# Altium schematic sheet 全场定位RM_v1.2.SchDoc
size A3; SheetNumber: 1; SheetTotal: 1
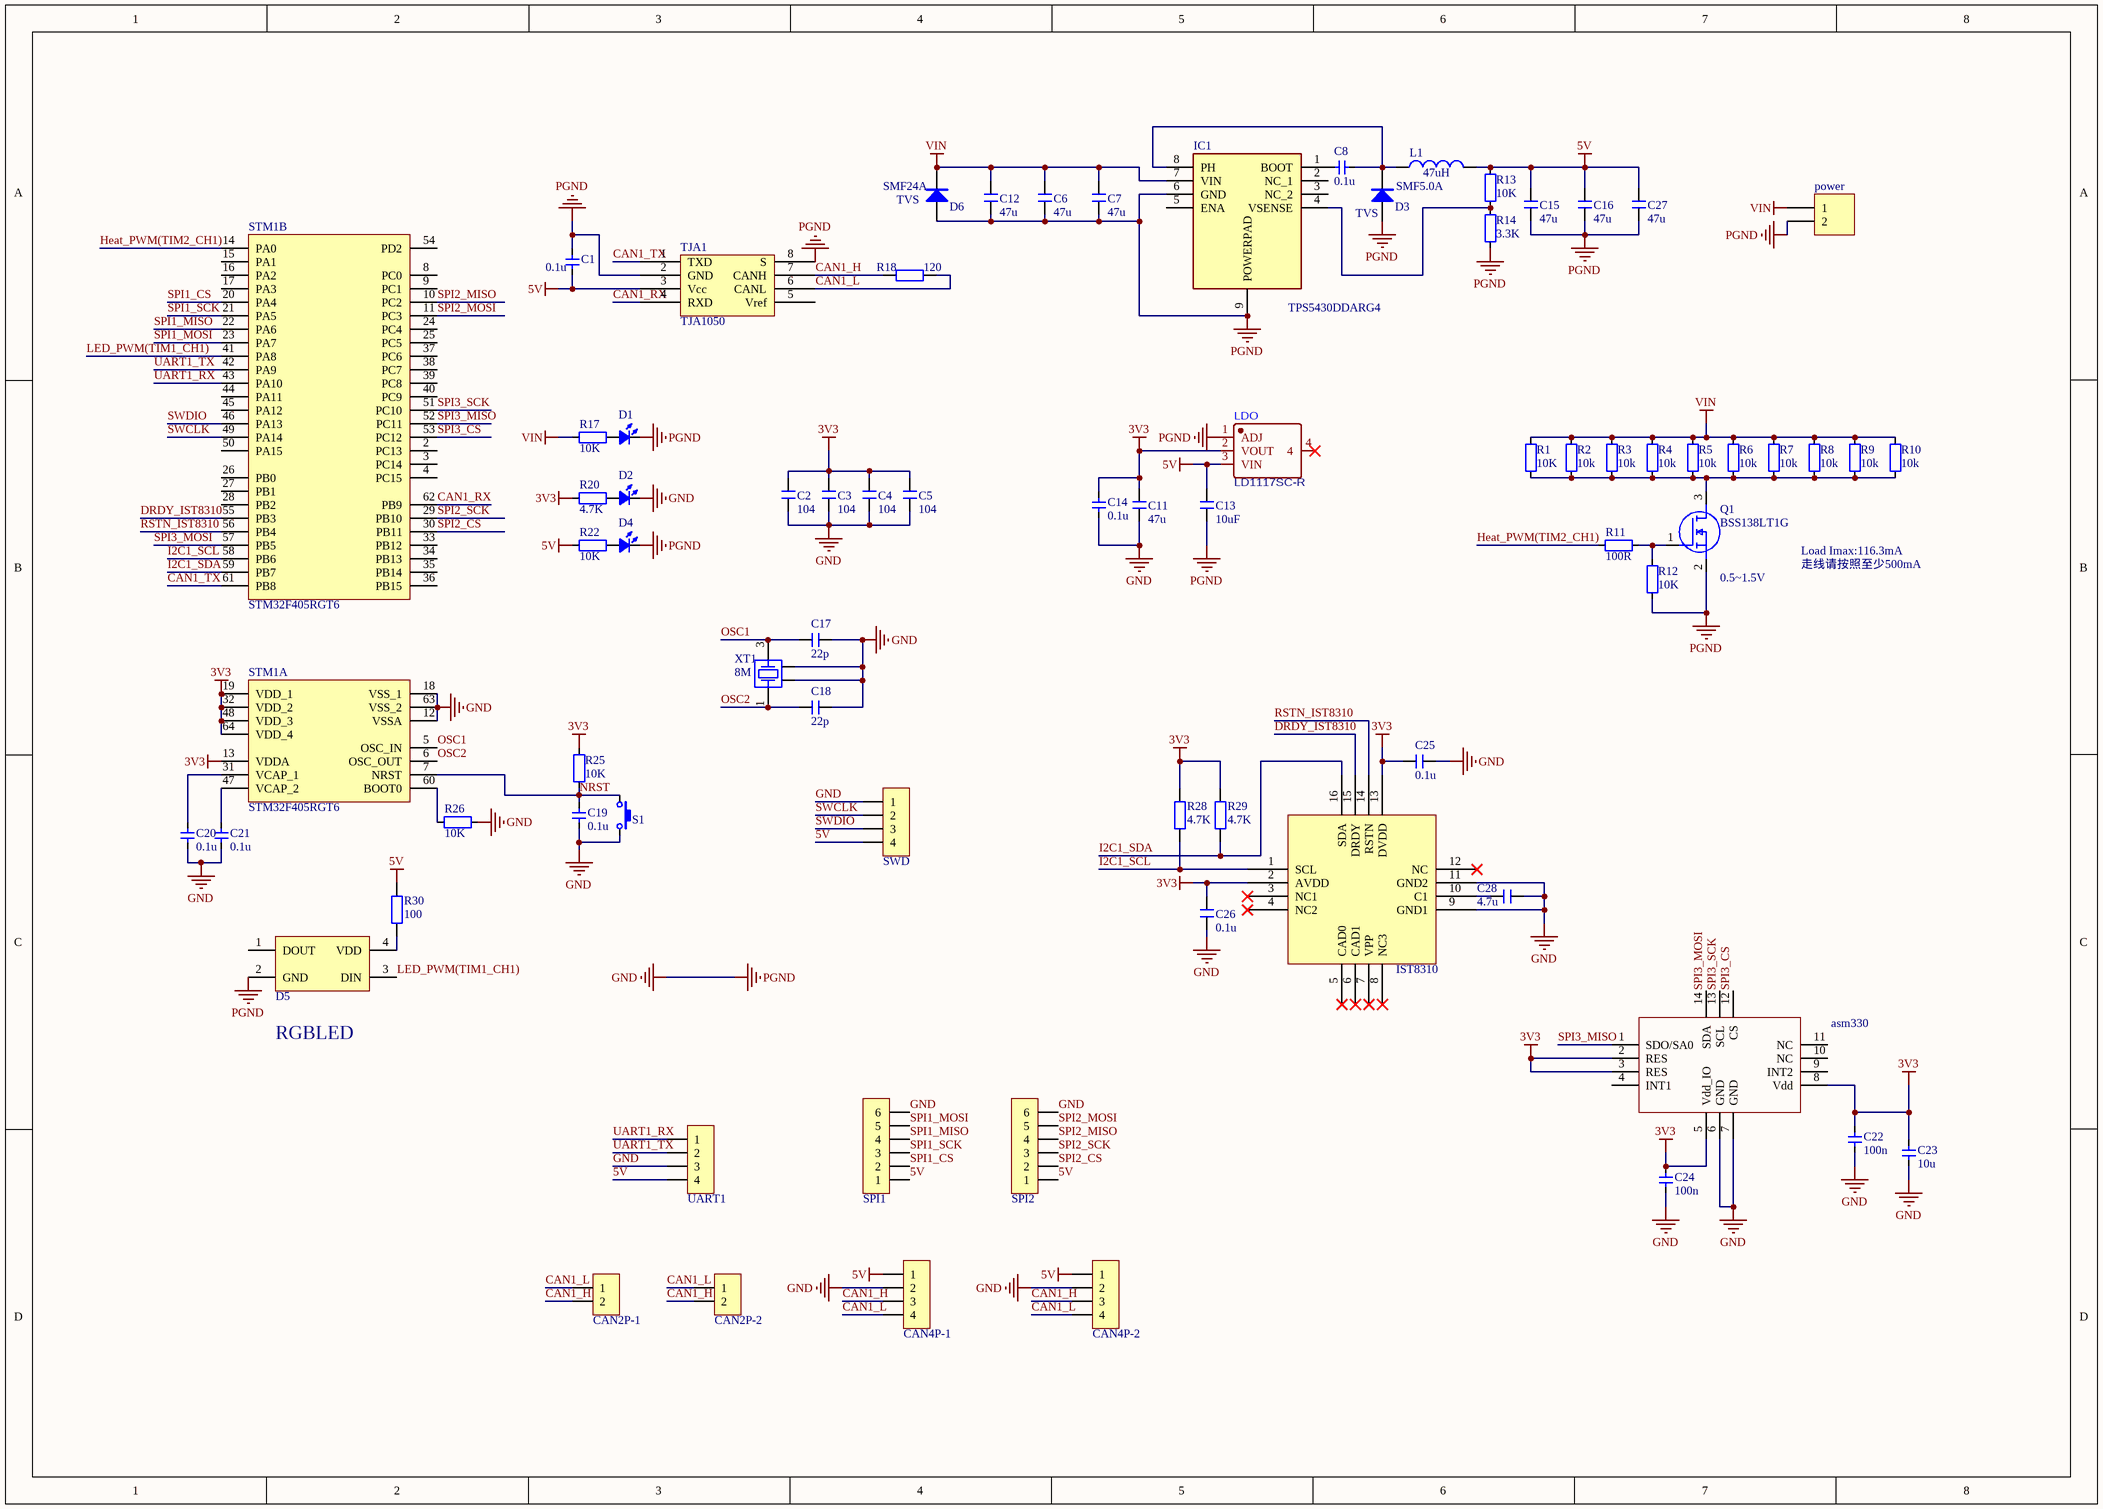
[diagram p0: 全场定位RM_v1.2.SchDoc]

## Parts
?  IST8310  [LGA-16(3mm*3mm)]
asm330  ASM330LHH  [LGA-14(2.5X3X0.86)]  (value not drawn)
C1  value 0.1u  [C 0603_L]  (hidden comment: Cap_0603)
C2  104  [C 0603_L]
C3  104  [C 0603_L]
C4  104  [C 0603_L]
C5  104  [C 0603_L]
C6  47u  [C 1206_L]
C7  47u  [C 1206_L]
C8  value 0.1u  [C 0603_L]  (hidden comment: Cap_0603)
C11  47u  [C 1206_L]
C12  47u  [C 1206_L]
C13  10uF  [C 0603_L]
C14  value 0.1u  [C 0603_L]  (hidden comment: Cap_0603)
C15  47u  [C 1206_L]
C16  47u  [C 1206_L]
C17  22p  [C 0603_L]
C18  22p  [C 0603_L]
C19  value 0.1u  [C 0603_L]  (hidden comment: Cap_0603)
C20  value 0.1u  [C 0603_L]  (hidden comment: Cap_0603)
C21  value 0.1u  [C 0603_L]  (hidden comment: Cap_0603)
C22  value 100n  [C 0603_L]  (hidden comment: Cap_0603)
C23  value 10u  [C 0603_L]  (hidden comment: Cap_0603)
C24  value 100n  [C 0603_L]  (hidden comment: Cap_0603)
C25  0.1u  [C 0603_L]
C26  0.1u  [C 0603_L]
C27  47u  [C 1206_L]
C28  4.7u  [C 0603_L]
CAN2P-1  HDR-1X2  [GH1.25-LT-2P]  (value not drawn)
CAN2P-2  HDR-1X2  [GH1.25-LT-2P]  (value not drawn)
CAN4P-1  HDR-1X4  [GH1.25-LS-4P]  (value not drawn)
CAN4P-2  HDR-1X4  [GH1.25-LS-4P]  (value not drawn)
D1  LED_0805  [LED_0805_YELLOW]  (value not drawn)
D2  LED_0805  [LED_0805_YELLOW]  (value not drawn)
D3  TVS  [SOD-123F]  (value not drawn)
D4  LED_0805  [LED_0805_YELLOW]  (value not drawn)
D5  LED_3535_SK6812  [LED_3535_4P]  (value not drawn)
D6  TVS  [SOD-123F]  (value not drawn)
IC1  TPS5430DDARG4  [SOIC127P600X170-9N]
L1  value 47uH  [CD73]  (hidden comment: Inductor)
LDO  LD1117SC-R  [SOT-223]
power  Header 2  [XT30-M]  (value not drawn)
Q1  BSS138LT1G  [SOT96P237X111-3N]
R1  value 10K  [R 0402_L]  (hidden comment: Res_0603)
R2  value 10k  [R 0402_L]  (hidden comment: Res_0603)
R3  value 10k  [R 0402_L]  (hidden comment: Res_0603)
R4  value 10k  [R 0402_L]  (hidden comment: Res_0603)
R5  value 10k  [R 0402_L]  (hidden comment: Res_0603)
R6  value 10k  [R 0402_L]  (hidden comment: Res_0603)
R7  value 10k  [R 0402_L]  (hidden comment: Res_0603)
R8  value 10k  [R 0402_L]  (hidden comment: Res_0603)
R9  value 10k  [R 0402_L]  (hidden comment: Res_0603)
R10  value 10k  [R 0402_L]  (hidden comment: Res_0603)
R11  value 100R  [R 0603_L]  (hidden comment: Res_0603)
R12  value 10K  [R 0603_L]  (hidden comment: Res_0603)
R13  value 10K  [R 0603_L]  (hidden comment: Res_0603)
R14  value 3.3K  [R 0603_L]  (hidden comment: Res_0603)
R17  value 10K  [R 0603_L]  (hidden comment: Res_0603)
R18  120  [R 0603_L]
R20  value 4.7K  [R 0603_L]  (hidden comment: Res_0603)
R22  value 10K  [R 0603_L]  (hidden comment: Res_0603)
R25  value 10K  [R 0603_L]  (hidden comment: Res_0603)
R26  value 10K  [R 0603_L]  (hidden comment: Res_0603)
R28  4.7K  [R 0603_L]
R29  4.7K  [R 0603_L]
R30  100  [R 0603_L]
S1  ButtonTACT_3x4x2_180  [ButtonTACT_3x4x2_180H]  (value not drawn)
SPI1  HDR-1X6  [GH1.25-LS-6P]  (value not drawn)
SPI2  HDR-1X6  [GH1.25-LS-6P]  (value not drawn)
STM1  STM32F405RGT6  [LQFP64 10x10_M]  (parts A,B of 2)
SWD  HDR-1X4  [MX 1.25-WS-4P]  (value not drawn)
TJA1  TJA1050  [SOP_E150_8]
UART1  HDR-1X4  [GH1.25-LS-4P]  (value not drawn)
XT1  8M  [OSC 3225-4P]

## Nets
3V3: ?.2(AVDD) ?.13(DVDD) asm330.2(RES) asm330.3(RES) asm330.5(Vdd_IO) asm330.8(Vdd) C2.2 C3.2 C4.2 C5.2 C11.2 C14.1 C22.1 C23.1 C24.1 C25.1 C26.2 LDO.2(VOUT) R20.1 R25.1 R28.2 R29.2 STM1.13(VDDA) STM1.19(VDD_1) STM1.32(VDD_2) STM1.48(VDD_3) STM1.64(VDD_4)
5V: C1.1 C13.2 C15.2 C16.2 C27.2 CAN4P-1.1 CAN4P-2.1 L1.2 LDO.3(VIN) R13.1 R22.1 R30.2 SPI1.1 SPI2.1 SWD.4 TJA1.3(Vcc) UART1.4
GND: ?.9(GND1) ?.11(GND2) asm330.6(GND) asm330.7(GND) C1.2 C2.1 C3.1 C4.1 C5.1 C6.1 C7.1 C11.1 C12.1 C13.1 C14.2 C15.1 C16.1 C17.2 C18.2 C19.1 C20.2 C21.2 C22.2 C23.2 C24.2 C25.2 C26.1 C27.1 C28.1 CAN4P-1.2 CAN4P-2.2 D1.2(K) D2.2(K) D3.1(A) D4.2(K) D5.2(GND) D6.1(A) IC1.6(GND) IC1.9(POWERPAD) LDO.1(ADJ) power.2 Q1.2(S) R12.2 R14.2 R26.2 S1.2 SPI1.6 SPI2.6 STM1.12(VSSA) STM1.18(VSS_1) STM1.63(VSS_2) SWD.1 TJA1.2(GND) TJA1.8(S) UART1.3 XT1.2 XT1.4  [also labelled PGND]
VIN: C6.2 C7.2 C12.2 D6.2(K) IC1.7(VIN) power.1 R1.1 R2.1 R3.1 R4.1 R5.1 R6.1 R7.1 R8.1 R9.1 R10.1 R17.1
CAN1_H: CAN2P-1.2 CAN2P-2.2 CAN4P-1.3 CAN4P-2.3 R18.1 TJA1.7(CANH)
CAN1_L: CAN2P-1.1 CAN2P-2.1 CAN4P-1.4 CAN4P-2.4 R18.2 TJA1.6(CANL)
CAN1_RX: STM1.62(PB9) TJA1.4(RXD)
CAN1_TX: STM1.61(PB8) TJA1.1(TXD)
DRDY_IST8310: ?.15(DRDY) STM1.55(PB3)
Heat_PWM(TIM2_CH1): R11.1 STM1.14(PA0)
I2C1_SCL: ?.1(SCL) R28.1 STM1.58(PB6)
I2C1_SDA: ?.16(SDA) R29.1 STM1.59(PB7)
LED_PWM(TIM1_CH1): D5.3(DIN) STM1.41(PA8)
NRST: C19.2 R25.2 S1.1 STM1.7(NRST)
OSC1: C17.1 STM1.5(OSC_IN) XT1.3
OSC2: C18.1 STM1.6(OSC_OUT) XT1.1
RSTN_IST8310: ?.14(RSTN) STM1.56(PB4)
SPI1_CS: SPI1.2 STM1.20(PA4)
SPI1_MISO: SPI1.4 STM1.22(PA6)
SPI1_MOSI: SPI1.5 STM1.23(PA7)
SPI1_SCK: SPI1.3 STM1.21(PA5)
SPI2_CS: SPI2.2 STM1.30(PB11)
SPI2_MISO: SPI2.4 STM1.10(PC2)
SPI2_MOSI: SPI2.5 STM1.11(PC3)
SPI2_SCK: SPI2.3 STM1.29(PB10)
SPI3_CS: asm330.12(CS) STM1.53(PC12)
SPI3_MISO: asm330.1(SDO/SA0) STM1.52(PC11)
SPI3_MOSI: asm330.14(SDA) STM1.57(PB5)
SPI3_SCK: asm330.13(SCL) STM1.51(PC10)
SWCLK: STM1.49(PA14) SWD.2
SWDIO: STM1.46(PA13) SWD.3
UART1_RX: STM1.43(PA10) UART1.1
UART1_TX: STM1.42(PA9) UART1.2
Net?_10: ?.10(C1) C28.2
NetC8_1: C8.1 D3.2(K) IC1.8(PH) L1.1
NetC8_2: C8.2 IC1.1(BOOT)
NetC20_1: C20.1 STM1.31(VCAP_1)
NetC21_1: C21.1 STM1.47(VCAP_2)
NetD1_1: D1.1(A) R17.2
NetD2_1: D2.1(A) R20.2
NetD4_1: D4.1(A) R22.2
NetD5_4: D5.4(VDD) R30.1
NetIC1_4: IC1.4(VSENSE) R13.2 R14.1
NetQ1_1: Q1.1(G) R11.2 R12.1
NetQ1_3: Q1.3(D) R1.2 R2.2 R3.2 R4.2 R5.2 R6.2 R7.2 R8.2 R9.2 R10.2
NetR26_1: R26.1 STM1.60(BOOT0)

Not connected (* = marked no-connect by the designer): ? 3(NC1)* 4(NC2)* 5(CAD0)* 6(CAD1)* 7(VPP)* 8(NC3)* 12(NC)*; asm330 4(INT1) 9(INT2) 10(NC) 11(NC); D5 1(DOUT); IC1 2(NC_1) 3(NC_2) 5(ENA); LDO 4*; STM1 2(PC13) 3(PC14) 4(PC15) 8(PC0) 9(PC1) 15(PA1) 16(PA2) 17(PA3) 24(PC4) 25(PC5) 26(PB0) 27(PB1) 28(PB2) 33(PB12) 34(PB13) 35(PB14) 36(PB15) 37(PC6) 38(PC7) 39(PC8) 40(PC9) 44(PA11) 45(PA12) 50(PA15) 54(PD2); TJA1 5(Vref)

## Notes on the sheet
- (near D6) SMF24A
- (near D6) TVS
- (near D3) TVS
- SMF5.0A
- (near Q1) 0.5~1.5V
- Load Imax:116.3mA
- 走线请按照至少500mA
- (near D5) RGBLED

## Library data of the parts
C1 C8 C14 C19-C24 = Cap_0603: Capacitor
C2-C7 C11-C13 C15-C18 C25-C28 = C: 贴片电容; 淘宝ID: 小糖豆的小窝窝; BOM名称: 贴片电容; 下单链接: https://item.taobao.com/item.htm?ft=t&id=613637044352
CAN2P-1 CAN2P-2 = Header 2: 2P接插件; 淘宝ID: 小糖豆的小窝窝; BOM名称: 2P接插件; 下单链接: https://item.taobao.com/item.htm?ft=t&id=613637044352
CAN4P-1 CAN4P-2 SWD UART1 = Header 4: 4P接插件; 淘宝ID: 小糖豆的小窝窝; BOM名称: 4P接插件; 下单链接: https://item.taobao.com/item.htm?ft=t&id=613637044352
D1 D2 D4 = LED_0805: LED
D3 D6 = TVS: TVS保护; 淘宝ID: 小糖豆的小窝窝; BOM名称: TVS保护; 下单链接: https://item.taobao.com/item.htm?ft=t&id=613637044352
D5 = LED_3535_SK6812: LED
IC1 = TPS5430DDARG4: Integrated Circuit; Manufacturer_Name: Texas Instruments; Datasheet Link: http://www.ti.com/general/docs/suppproductinfo.tsp?distId=10&gotoUrl=http%3A%2F%2Fwww.ti.com%2Flit%2Fgpn%2Ftps5431; Height: 1.7mm; Manufacturer_Part_Number: TPS5430DDARG4; Mouser Part Number: 595-TPS5430DDARG4; Mouser Price/Stock: https://www.mouser.co.uk/ProductDetail/Texas-Instruments/TPS5430DDARG4?qs=zwk82MlA57YG4K%2FfUMTveg%3D%3D
L1 = Inductor: Code_IEC: 1005; Published: 8-Jun-2000; LatestRevisionDate: 17-Jul-2002; LatestRevisionNote: Re-released for DXP Platform.; PackageReference: 0402-A; Publisher: Altium Limited; Code_JEITA: 0402
power = Header 2: Header, 2-Pin; LatestRevisionDate: 17-Jul-2002; LatestRevisionNote: Re-released for DXP Platform.; Publisher: Altium Limited
Q1 = BSS138LT1G: MOSFET (N-Channel); Manufacturer_Name: onsemi; Datasheet Link: http://www.onsemi.com/pub/Collateral/BSS138LT1-D.PDF; Height: 1.11mm; Manufacturer_Part_Number: BSS138LT1G; Mouser Part Number: 863-BSS138LT1G; Mouser Price/Stock: https://www.mouser.co.uk/ProductDetail/onsemi/BSS138LT1G?qs=vNc2DXHODiKPZ2y3rQhTYQ%3D%3D; Arrow Part Number: BSS138LT1G; Arrow Price/Stock: null?region=asia
R1-R14 R17 R20 R22 R25 R26 = Res_0603: Resistor
R18 R28-R30 = R: 贴片电阻; 淘宝ID: 小糖豆的小窝窝; BOM名称: 贴片电阻; 下单链接: https://item.taobao.com/item.htm?ft=t&id=613637044352
S1 = ButtonTACT_3x4x2_180: Button
SPI1 SPI2 = Header 6: 6P接插件; 淘宝ID: 小糖豆的小窝窝; BOM名称: 6P接插件; 下单链接: https://item.taobao.com/item.htm?ft=t&id=613637044352
STM1 = STM32F405R: MCU
XT1 = XTAL-4P: 4脚无源晶振; 淘宝ID: 小糖豆的小窝窝; BOM名称: 4脚无源晶振; 下单链接: https://item.taobao.com/item.htm?ft=t&id=613637044352